# EAGLE design emonBuck v0.2 (EAGLE 9.2.2)
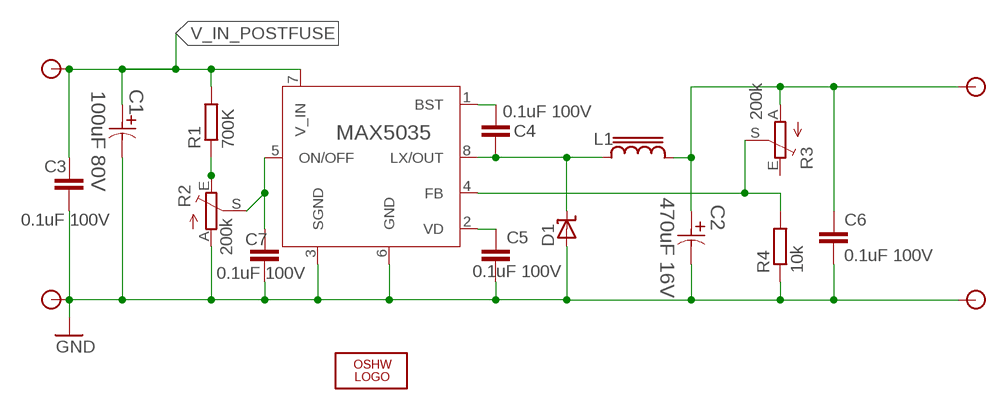
[diagram p0: schematic, sheet 1]

## Parts
C1  100uF 80V  EEV-FK1K101Q-CASE-H13  [CAPAE1350X1400N]
C2  470uF 16V  EEE-FK1C471P-CASE-F  [CAPAE830X1050N]
C3  0.1uF 100V  C-EUC0603  [C0603]
C4  0.1uF 100V  C-EUC0603  [C0603]
C5  0.1uF 100V  C-EUC0603  [C0603]
C6  0.1uF 100V  C-EUC0603  [C0603]
C7  0.1uF 100V  C-EUC0603  [C0603]
D1  MBRS1100T3G  [SMB_1]
L1  SRR1208  [SSR1208]
LOGO1  OSHW_LOGO_6MILX0200-NT  [OSHW_6X200_NOTEXT]
MAX5035  MAX5035  [21-0111D_SBE-14]
R1  700K  R-EU_R0603  [R0603]
R2  200k  TRIM_EU-B64W  [B64W]
R3  200k  TRIM_EU-B64W  [B64W]
R4  10k  R-EU_R0603  [R0603]
U$1  TP0.8MM  [TP0.8]
U$2  TP0.8MM  [TP0.8]
U$3  TP0.8MM  [TP0.8]
U$4  TP0.8MM  [TP0.8]

## Nets
BST [thin_power]: C4.1 MAX5035.1(BST)
GND: C1.2 C2.2 C3.2 C5.2 C6.2 C7.2 D1.A MAX5035.3(SGND) MAX5035.6(GND) R2.A R4.1 U$2.P$1 U$4.P$1
LX [thin_power]: C4.2 D1.C L1.1 MAX5035.8(LX/OUT)
N$1: MAX5035.4(FB) R3.S R4.2
N$2: C7.1 MAX5035.5(ON/OFF) R2.S
N$3 [thin_power]: R1.1 R2.E
PRE_6.5V [thin_power]: C2.1 C6.1 L1.2 R3.A U$3.P$1
V_IN_POSTFUSE [thin_power]: C1.1 C3.1 MAX5035.7(V_IN) R1.2 U$1.P$1
VD [thin_power]: C5.1 MAX5035.2(VD)
Unconnected: R3.E

## Library data of the parts
C1 = Panasonic-EEE-EEV-EEF-ECQ:EEV-: Aluminum Electrolytic Capacitors,Surface Mount Type; MPN: EEVFK1K101Q; OC_FARNELL: 9696113; OC_NEWARK: 96K9484; SUPPLIER: PANASONIC; TOLERANCE: ±20 %; VALUE: 100UF; VOLTAGERATING: 80V
C2 = Panasonic-EEEFK_EEEFP:EEE-: Aluminum Electrolytic Capacitors,Surface Mount Type; MPN: EEE-FK1C471P; OC_FARNELL: 9695710; OC_NEWARK: 96K9385; PACKAGE: CASE-F; SUPPLIER: PANASONIC; TOLERANCE: ±20 %; VALUE: 470UF; VOLTAGERATING: 16V
C3-C7 = rcl:C-EU: CAPACITOR, European symbol; SPICEPREFIX: C
D1 = diodes:MBRS1100T3G: MBRS1100T3G 100V 1A Freewheeling Diode; MPN: MBRS1100T3G
L1 = inductor-bourns:SRR1208: POWER INDUCTOR; MPN: SRR1208-151YL
LOGO1 = ohw-logo:OSHW_LOGO_6MIL; OC_FARNELL: unknown
MAX5035 = MAX5035:MAX5035: SWITCHING REGULATOR 5.0V 1.0A; MPN: MAX5035EASA+
R1 R4 = rcl@1:R-EU_: RESISTOR, European symbol
R2 R3 = pot:TRIM_EU-: POTENTIOMETER
U$1-U$4 = testpad_db:TP

## Net classes
0 default: clearance 0.203 mm
1 power: width 0.61 mm, clearance 0.61 mm
2 thin_power: width 0.406 mm, clearance 0.305 mm

## Board
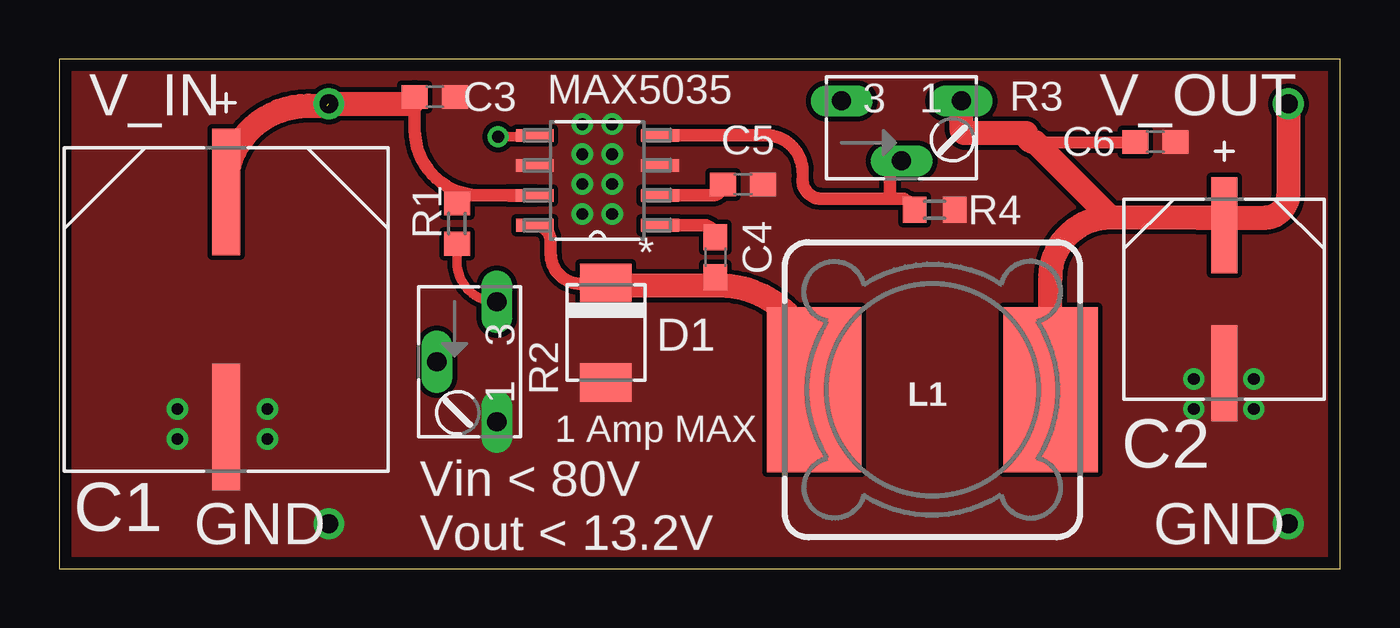
[diagram p1: board, top side]
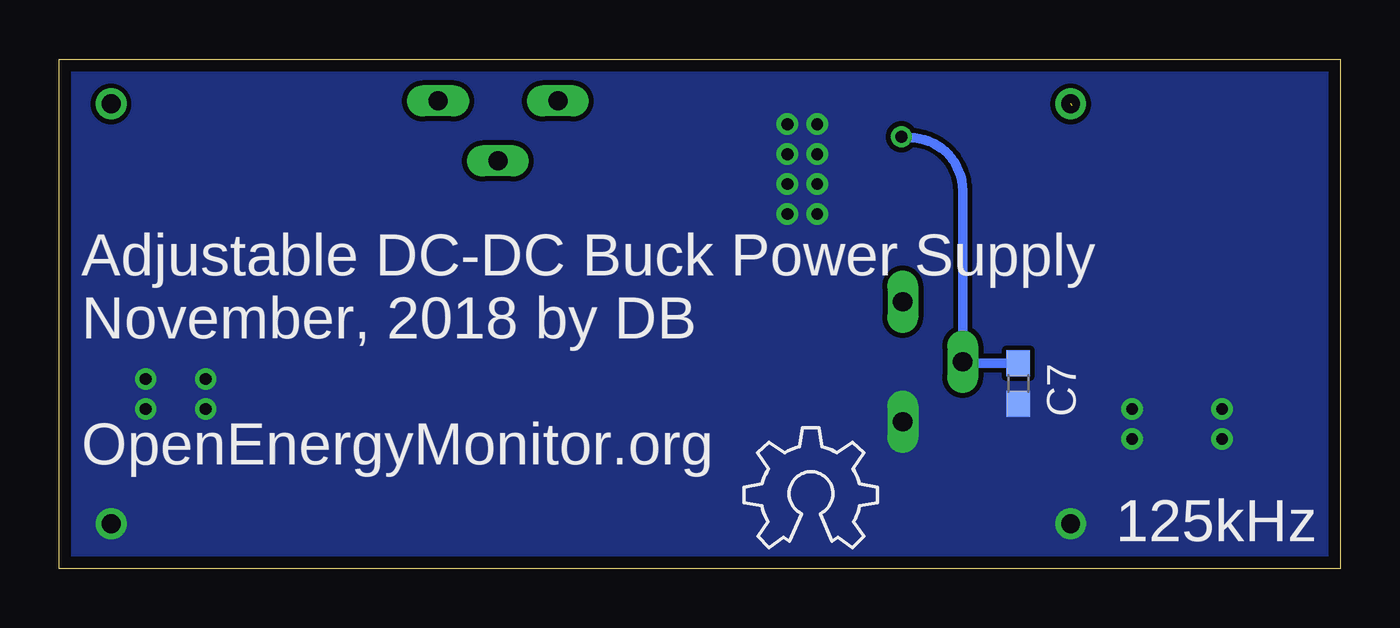
[diagram p2: board, bottom side, seen from below]

Size 54.28 x 21.58 mm. Coordinates in mm from the lower left corner, seen from the top.
Outline: 0,0 54.28,0 54.28,21.58 0,21.58 0,0
Copper layers (1*16): Top 0.035mm / dielectric 0.15mm / Bottom 0.035mm
Design rules "default *": minimum track width 6mil, minimum drill 0.35mm, track to track 6mil, track to pad 6mil, pad to pad 6mil, via to via 6mil, smd to smd 6mil, copper to edge 20mil, drill to drill 6mil, minimum pad ring 10mil, minimum via ring 8mil, stop-mask expansion 4mil, vias tented up to drill 0mil, thermal gap 10mil

### Footprints (pad centres in the part's own frame; a part is rotated, then mirrored left to right if it is on the bottom)
CAPAE1350X1400N = smd 5.359 x 1.194: 1 -4.978,0; 2 4.978,0
CAPAE830X1050N = smd 4.064 x 1.092: 1 -3.124,0; 2 3.124,0
C0603 = smd 1.1 x 1: 1 -0.85,0; 2 0.85,0
SMB_1 = smd 1.62 x 2.18: A 2.11,0; C -2.11,0
SSR1208 = smd 7 x 4: 1 0,5; 2 0,-5
21-0111D_SBE-14 = smd 1.6 x 0.533: 1 -2.654,1.905; 2 -2.654,0.635; 3 -2.654,-0.635; 4 -2.654,-1.905; 5 2.654,-1.905; 6 2.654,-0.635; 7 2.654,0.635; 8 2.654,1.905
R0603 = smd 1 x 1.1: 1 -0.85,0; 2 0.85,0
B64W = drill 0.813 long: A 2.54,0; E -2.54,0; S 0,-2.54
TP0.8 = drill 0.8: P$1 0,0

### Placement (x,y rotation side)
C1  7.08,10.98 270 top
C2  49.35,11.41 270 top
C3  15.92,19.97 0 top
C4  27.8,13.19 270 top
C5  28.97,16.27 0 top
C6  46.44,18.06 0 top
C7  13.65,7.84 270 bottom
D1  23.17,9.99 270 top
L1  37,7.58 90 top
LOGO1  25.27,0.89 0 bottom
MAX5035  22.81,16.45 180 top
R1  16.85,14.61 90 top
R2  18.54,8.76 270 top
R3  35.69,19.81 0 top
R4  37.09,15.2 180 top
U$1  11.43,19.68 0 top
U$2  11.43,1.91 0 top
U$3  52.07,19.68 0 top
U$4  52.07,1.91 0 top

### Tracks (layer width: path | path; a pad name or v marks a point on that pad's centre or on a via)
BST
  Top 0.533: MAX5035.1 27.3,14.54 arc-90 C4.1
GND  (via drill 0.5)
  other vias: 23.43,17.55 22.16,17.55 22.16,16.28 23.43,16.28 23.43,15.01 22.16,15.01 23.43,18.82 22.16,18.82 5.02,5.49 5.02,6.76 8.83,6.76 8.83,5.49 48.07,6.76 48.07,8.03 50.61,8.03 50.61,6.76
  pour Top (no thermals): 0,21.59 54.61,21.59 54.61,0 0,0
  pour Bottom (no thermals): 0,21.59 54.61,21.59 54.61,0 0,0
LX
  Top 0.406: C4.2 27.8,12.12 arc90 27.94,11.98
  Top 0.508: D1.C 23.17,12.07 23.17,11.98
  Top 0.533: MAX5035.8 arc-90 20.83,13.86 20.83,13.34 arc90 22.1,12.07 23.17,12.07
  Top 1.016: L1.1 32,8.05 arc90 27.94,11.98 23.17,11.98
N$1
  Top 0.406: R4.2 arc90 35.78,15.66
  Top 0.508: 31.49,16.82 31.49,16.46
  Top 0.533: MAX5035.4 29.96,18.35 arc-90 31.49,16.82 | 31.49,16.46 arc90 32.29,15.66 35.32,15.66 | 35.32,15.66 35.78,15.66 | 35.32,15.66 arc-90 35.2,15.78 35.2,16.79 arc-90 R3.S
N$2  (via drill 0.5)
  Top 0.406: v18.6,18.29 20.09,18.29 arc90 MAX5035.5
  Bottom 0.406: v18.6,18.29 arc-90 18.56,18.25 18.25,18.25 arc90 16,16 R2.S arc-90 15.93,8.69 C7.1
N$3
  Top 0.406: R2.E arc-90 16.85,12.99 R1.1
PRE_6.5V
  Top 0.508: 41.35,18.06 C6.1 | C2.1 arc90 49.01,14.88
  Top 1.016: 44.54,14.88 41.35,18.06 arc-90 40.97,18.44 38.41,18.44 arc-90 38.23,18.63 R3.A | 44.54,14.88 48.26,14.88 | 48.26,14.88 49.01,14.88 | L1.2 42,12.34 arc-90 44.54,14.88 | 48.26,14.88 arc90 48.28,14.86 51.05,14.86 arc90 52.07,15.88 U$3.P$1
V_IN_POSTFUSE  (1 unrouted)
  Top 0.406: R1.2 arc-90 17.2,15.8 17.23,15.8
  Top 0.533: C3.1 15.07,18.59 arc90 17.86,15.8 | 17.86,15.8 20.14,15.8 | 17.23,15.8 17.86,15.8
  Top 0.559: 19.05,15.81 MAX5035.7 arc-90 20.14,15.8
  Top 1.016: 7.08,16.28 arc90 C1.1 7.08,16.13 arc-90 10.55,19.61 11.35,19.61 | 14.78,19.68 arc90 C3.1 14.78,19.68 | U$1.P$1 14.78,19.68
VD
  Top 0.533: MAX5035.2 27.66,15.81 arc90 C5.1

### Text on the board
tNames: V_IN | V_OUT | 1 Amp MAX | GND | GND | Vin < 80V / Vout < 13.2V
bNames: 125kHz | Adjustable DC-DC Buck Power Supply / November, 2018 by DB / / OpenEnergyMonitor.org